# Altium schematic sheet DDR3.SchDoc
size Tabloid; DocumentNumber: 1; SheetNumber: 1; SheetTotal: 3; Sheet_Name: PLEIADES MAIN; Size: 11x17
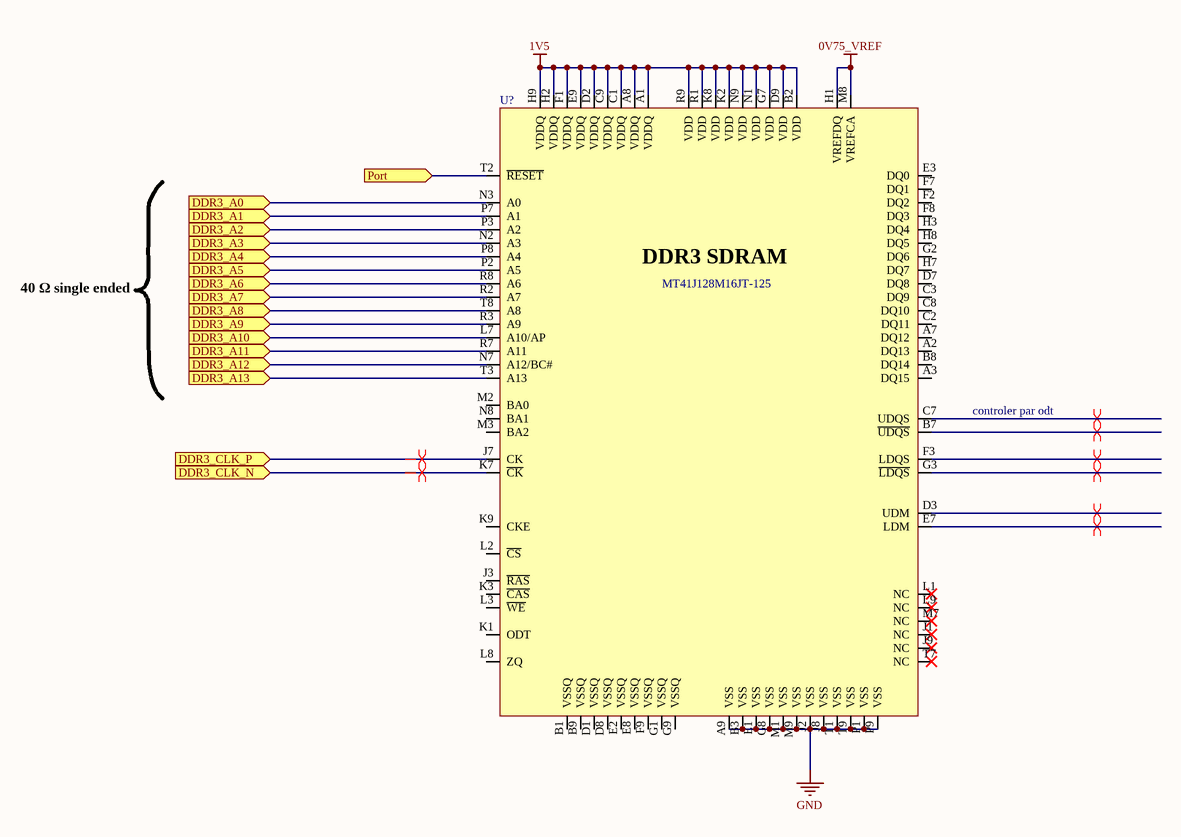
[diagram p0: DDR3.SchDoc]

## Parts
U?  MT41J128M16JT-125  [MEM_DDR3_MT41J128M16JT-125]

## Ports
DDR3_A0 (in), DDR3_A1 (in), DDR3_A2 (in), DDR3_A3 (in), DDR3_A4 (in), DDR3_A5 (in), DDR3_A6 (in), DDR3_A7 (in), DDR3_A8 (in), DDR3_A9 (in), DDR3_A10 (in), DDR3_A11 (in), DDR3_A12 (in), DDR3_A13 (in), DDR3_CLK_N (in), DDR3_CLK_P (in), Port (in)

## Nets
0V75_VREF: U?.H1(VREFDQ) U?.M8(VREFCA)
1V5: U?.A1(VDDQ) U?.A8(VDDQ) U?.B2(VDD) U?.C1(VDDQ) U?.C9(VDDQ) U?.D2(VDDQ) U?.D9(VDD) U?.E9(VDDQ) U?.F1(VDDQ) U?.G7(VDD) U?.H2(VDDQ) U?.H9(VDDQ) U?.K2(VDD) U?.K8(VDD) U?.N1(VDD) U?.N9(VDD) U?.R1(VDD) U?.R9(VDD)
GND: U?.A9(VSS) U?.B3(VSS) U?.E1(VSS) U?.G8(VSS) U?.J2(VSS) U?.J8(VSS) U?.M1(VSS) U?.M9(VSS) U?.P1(VSS) U?.P9(VSS) U?.T1(VSS) U?.T9(VSS)
DDR3_A0: U?.N3(A0) ; port DDR3_A0
DDR3_A1: U?.P7(A1) ; port DDR3_A1
DDR3_A2: U?.P3(A2) ; port DDR3_A2
DDR3_A3: U?.N2(A3) ; port DDR3_A3
DDR3_A4: U?.P8(A4) ; port DDR3_A4
DDR3_A5: U?.P2(A5) ; port DDR3_A5
DDR3_A6: U?.R8(A6) ; port DDR3_A6
DDR3_A7: U?.R2(A7) ; port DDR3_A7
DDR3_A8: U?.T8(A8) ; port DDR3_A8
DDR3_A9: U?.R3(A9) ; port DDR3_A9
DDR3_A10: U?.L7(A10/AP) ; port DDR3_A10
DDR3_A11: U?.R7(A11) ; port DDR3_A11
DDR3_A12: U?.N7(A12/BC#) ; port DDR3_A12
DDR3_A13: U?.T3(A13) ; port DDR3_A13
DDR3_CLK_N: U?.K7(~{CK}) ; port DDR3_CLK_N
DDR3_CLK_P: U?.J7(CK) ; port DDR3_CLK_P
Port: U?.T2(~{RESET}) ; port Port

Not connected (* = marked no-connect by the designer): U? A2(DQ13) A3(DQ15) A7(DQ12) B1(VSSQ) B7(~{UDQS}) B8(DQ14) B9(VSSQ) C2(DQ11) C3(DQ9) C7(UDQS) C8(DQ10) D1(VSSQ) D3(UDM) D7(DQ8) D8(VSSQ) E2(VSSQ) E3(DQ0) E7(LDM) E8(VSSQ) F2(DQ2) F3(LDQS) F7(DQ1) F8(DQ3) F9(VSSQ) G1(VSSQ) G2(DQ6) G3(~{LDQS}) G9(VSSQ) H3(DQ4) H7(DQ7) H8(DQ5) J1(NC)* J3(~{RAS}) J9(NC)* K1(ODT) K3(~{CAS}) K9(CKE) L1(NC)* L2(~{CS}) L3(~{WE}) L8(ZQ) L9(NC)* M2(BA0) M3(BA2) M7(NC)* N8(BA1) T7(NC)*

## Layout directives
differential pair: DDR3_CLK_N, DDR3_CLK_P, NetU?_B7, NetU?_C7, NetU?_D3, NetU?_E7, NetU?_F3, NetU?_G3

## Notes on the sheet
- 40 Ω single ended
- controler par odt
- Sheet Name
- Project Title
- Global Project
- Size
- Group
- Revision
- Date
- Sheet
- of
- Filename
- Designers
- (in symbol MEM_DDR3_MT41J128M16JT-125:K TR) DDR3 SDRAM

## Library data of the parts
U? = MEM_DDR3_MT41J128M16JT-125:K TR: MEM - DDR3 SDRAM 2GBIT 800MHZ - TFBGA-96; Voltage: 1.425 V ~ 1.575 V; Mfg: Micrel; Current: *; Power: *; Mfg Part Number: MT41J128M16JT-125; HelpURL: http://www.micron.com/~/media/Documents/Products/Data%20Sheet/DRAM/DDR3/2Gb_DDR3_SDRAM.pdf; CreatedBy: Jonathan Bouchard; Temperature: 0°C ~ 95°C (TC); Value: *; Precision: *; Package: TFBGA-96; Supplier 1: Digikey; Supplier Part Number 1: 557-1611-1-ND